# EAGLE design Esquema-Eletrico (EAGLE 9.3.0)
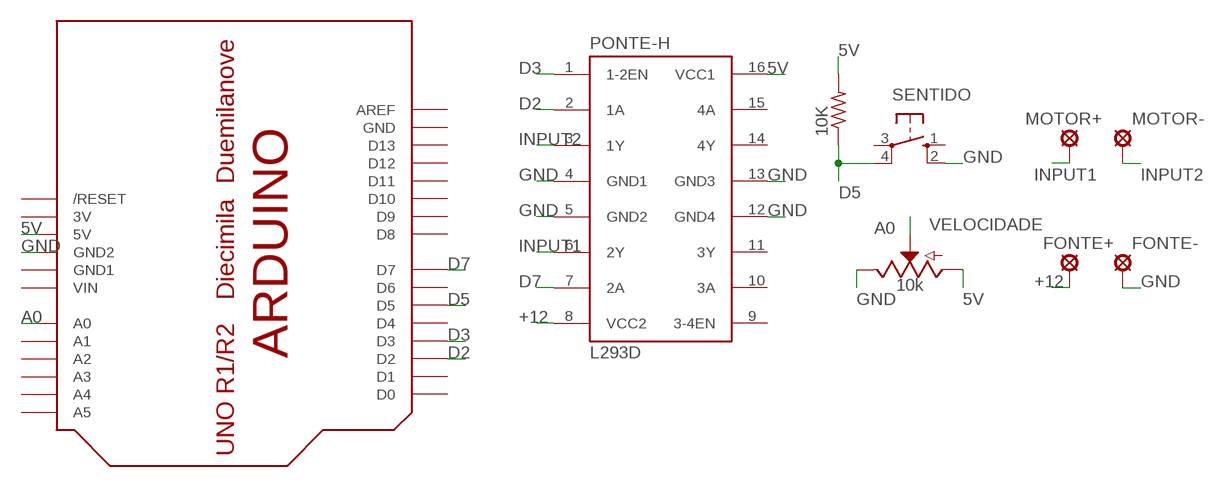
[diagram p0: schematic, sheet 1]

## Parts
10K  R-US_0207/12  [0207/12]
FONTE+  LSP10  [LSP10]
FONTE-  LSP10  [LSP10]
MOTOR+  LSP10  [LSP10]
MOTOR-  LSP10  [LSP10]
PONTE-H  L293D  [DIL16]
SENTIDO  10-XX  [B3F-10XX]
U$1  ARDUINOUNO  [ARDUINO]
VELOCIDADE  10k  POTENTIOMETER-PTH-9MM-1/20W-20%  [POT-PTH-ALPS]

## Nets
5V: 10K.2 PONTE-H.16(VCC1) U$1.5V VELOCIDADE.P$3(A)
+12: FONTE+.MP PONTE-H.8(VCC2)
A0: U$1.A0 VELOCIDADE.P$2(S)
D2: PONTE-H.2(1A) U$1.D2
D3: PONTE-H.1(1-2EN) U$1.D3
D5: 10K.1 SENTIDO.4(P1) U$1.D5
D7: PONTE-H.7(2A) U$1.D7
GND: FONTE-.MP PONTE-H.4(GND1) PONTE-H.5(GND2) PONTE-H.12(GND4) PONTE-H.13(GND3) SENTIDO.2(S1) U$1.GND2 VELOCIDADE.P$1(E)
INPUT1: MOTOR+.MP PONTE-H.6(2Y)
INPUT2: MOTOR-.MP PONTE-H.3(1Y)
Unconnected: PONTE-H.9(3-4EN) PONTE-H.10(3A) PONTE-H.11(3Y) PONTE-H.14(4Y) PONTE-H.15(4A) SENTIDO.1(S) SENTIDO.3(P) U$1.A1 U$1.A2 U$1.A3 U$1.A4 U$1.A5 U$1.AREF U$1.D0 U$1.D1 U$1.D4 U$1.D6 U$1.D8 U$1.D9 U$1.D10 U$1.D11 U$1.D12 U$1.D13 U$1.RESET(/RESET)

## Power pins joined to a net without a drawn wire
3V: U$1.3V
GND: U$1.GND
GND1: U$1.GND1
VIN: U$1.VIN

## Library data of the parts
10K = rcl:R-US_: RESISTOR, American symbol; SPICEPREFIX: R
FONTE+ FONTE- MOTOR+ MOTOR- = solpad:LSP10: SOLDER PAD drill 1.0 mm, distributor Buerklin, 12H555
PONTE-H = st-microelectronics:L293D: PUSH-PULL 4 CHANNEL DRIVER
SENTIDO = switch-omron:10-XX: OMRON SWITCH; MPN: B3F-1000; OC_FARNELL: 176432; OC_NEWARK: 36M3542
U$1 = adafruit:ARDUINO: Arduino Diecimila/Duemilanove Make a shield with ease, this package has all the named pins as well as the two mounting drill holes and an outline of the USB and DC power connector. The outline is on the DIMENSION layer, so if your board house uses it they will cut the outline to match. http://www.ladyada.net/library/pcb/eaglelibrary.html
VELOCIDADE = SparkFun-Resistors:POTENTIOMETER: Potentiometer (Pot) Three-terminal potentiometers, with an adjustable wiper and two adjustable resistors. A pot can be used to create a configurable voltage divider, or as a variable resistor. Variants ALPS_POT and ALPS_POT_KIT - PTH, breadboard compatible, 9mm square pots Rotary Potentiometer - Linear (10k ohm) <https://www.sparkfun.com/products/9288> (COM-09288) The KIT variant exposes copper on only one side of the PTH pad, so the part can only be assembled on one side of the PCB. Useful for beginner soldering kits.; PROD_ID: RES-09177; SF_SKU: COM-09288

## Net classes
0 default: width 0.6 mm, drill 1 mm, clearance 0.25 mm

## Board
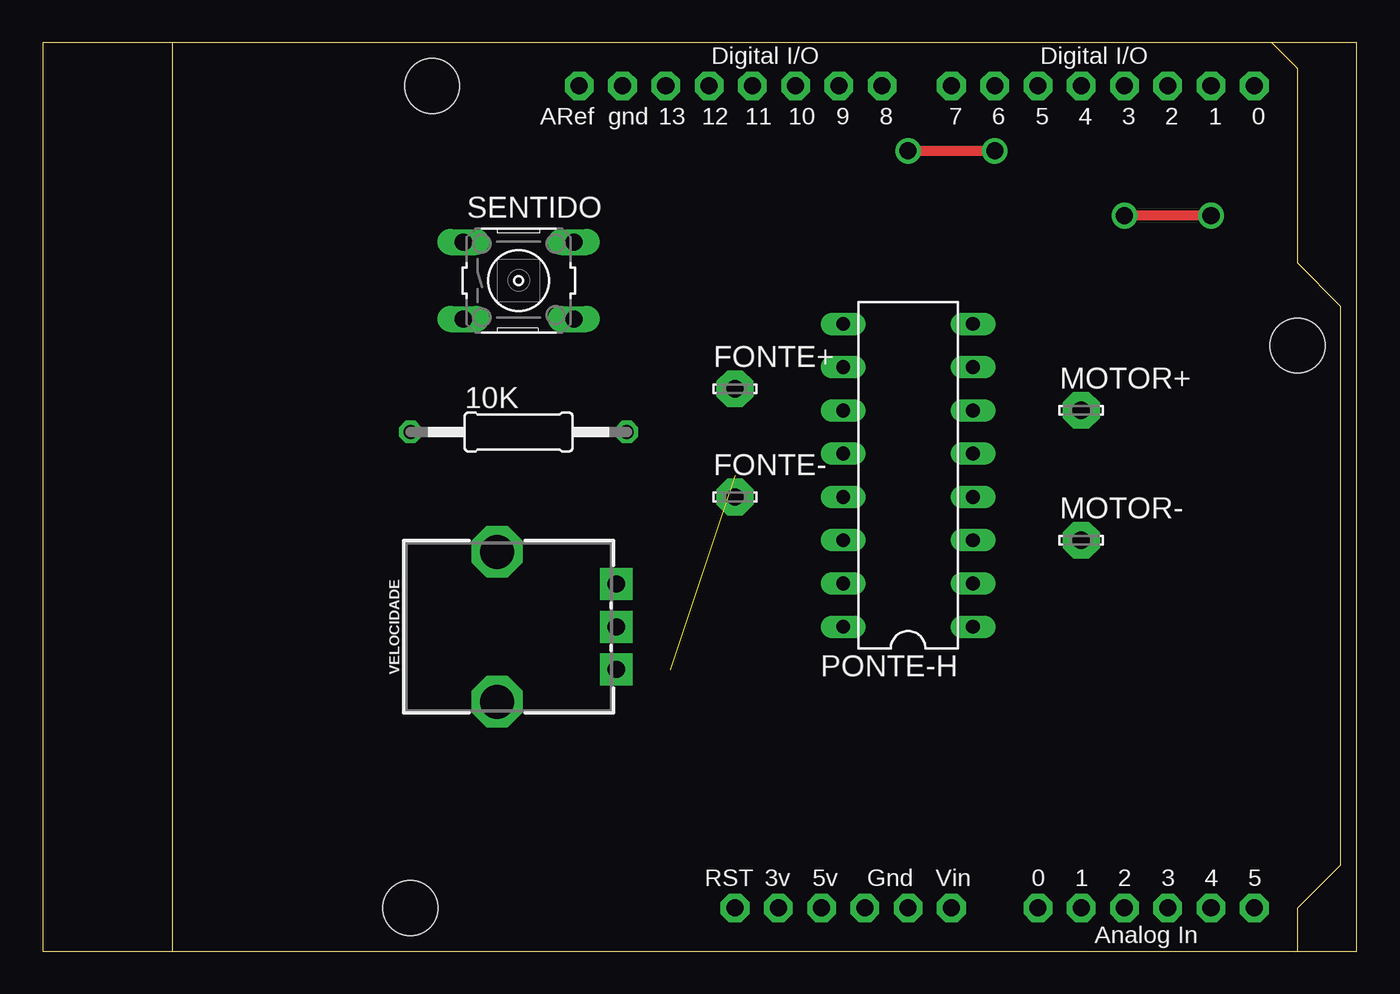
[diagram p1: board, top side]
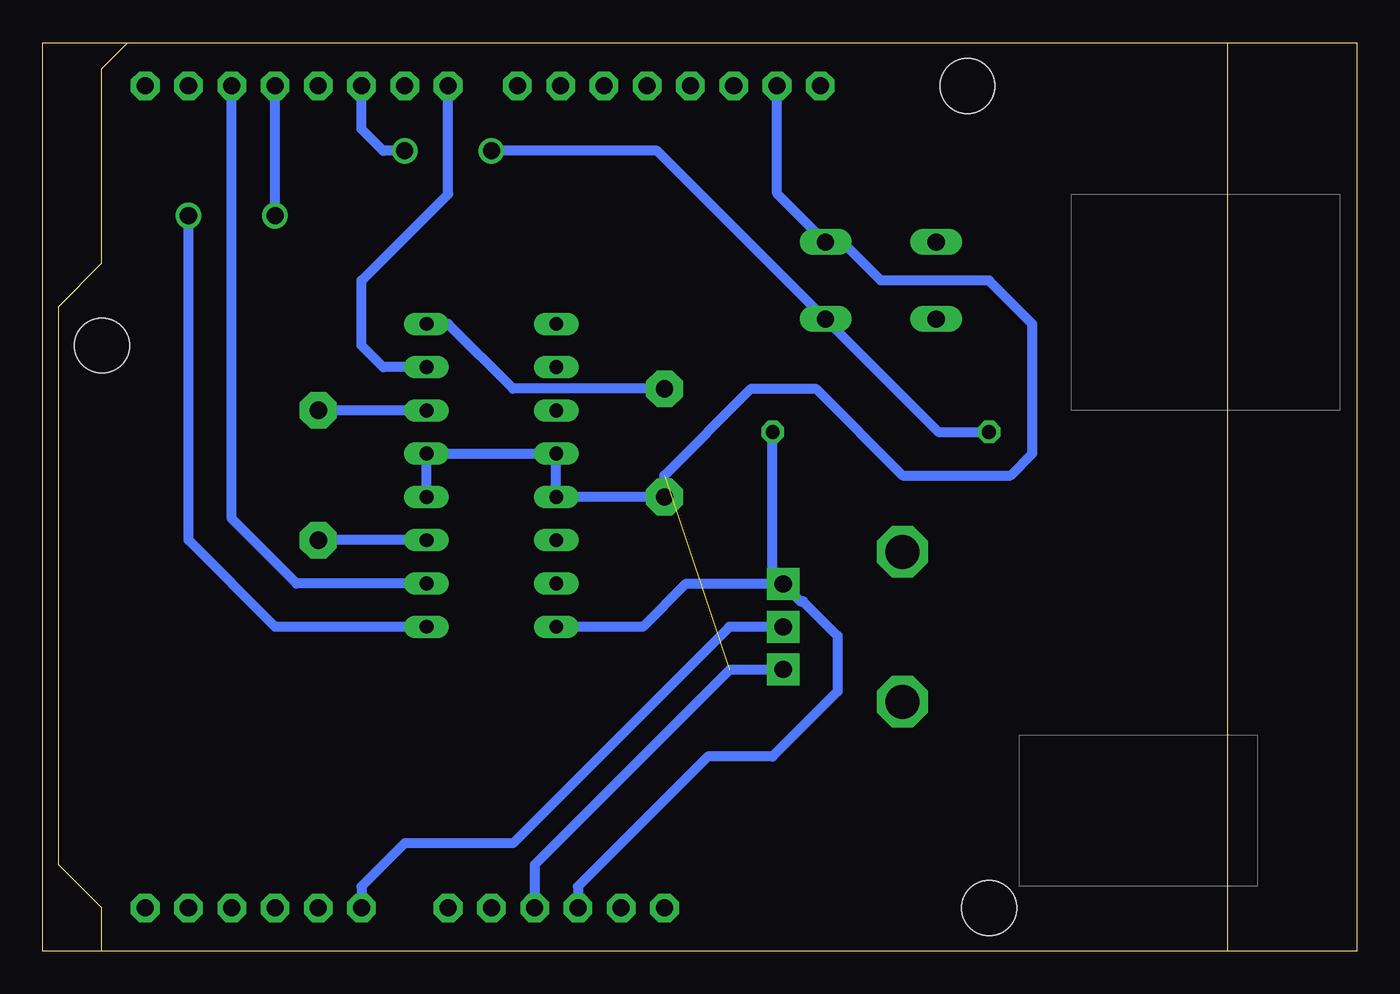
[diagram p2: board, bottom side, seen from below]

Size 77.14 x 53.34 mm. Coordinates in mm from the lower left corner, seen from the top.
Outline: 0,0 77.14,0 77.14,53.33 0,53.33 0,0
Copper layers (1*16): Top 0.035mm / dielectric 1.5mm / Bottom 0.035mm
Design rules "default": minimum track width 6mil, minimum drill 0.35mm, track to track 6mil, track to pad 6mil, pad to pad 6mil, via to via 6mil, smd to smd 6mil, copper to edge 40mil, drill to drill 6mil, minimum pad ring 10mil, minimum via ring 8mil, stop-mask expansion 4mil, vias tented up to drill 0mil, thermal gap 10mil

### Footprints (pad centres in the part's own frame; a part is rotated, then mirrored left to right if it is on the bottom)
0207/12 = drill 0.813 octagon: 1 -6.35,0; 2 6.35,0
LSP10 = drill 1.016 pad 2.159 octagon: MP 0,0
DIL16 = drill 0.813 long: 1 -8.89,-3.81; 2 -6.35,-3.81; 3 -3.81,-3.81; 4 -1.27,-3.81; 5 1.27,-3.81; 6 3.81,-3.81; 7 6.35,-3.81; 8 8.89,-3.81; 9 8.89,3.81; 10 6.35,3.81; 11 3.81,3.81; 12 1.27,3.81; 13 -1.27,3.81; 14 -3.81,3.81; 15 -6.35,3.81; 16 -8.89,3.81
B3F-10XX = drill 1.016 long: 1 -3.251,2.261; 2 3.251,2.261; 3 -3.251,-2.261; 4 3.251,-2.261
ARDUINO = drill 1 pad 1.676 octagon: 3V 35.56,2.54; 5V 38.1,2.54; A0 50.8,2.54; A1 53.34,2.54; A2 55.88,2.54; A3 58.42,2.54; A4 60.96,2.54; A5 63.5,2.54; AREF 23.876,50.8; D0 63.5,50.8; D1 60.96,50.8; D2 58.42,50.8; D3 55.88,50.8; D4 53.34,50.8; D5 50.8,50.8; D6 48.26,50.8; D7 45.72,50.8; D8 41.656,50.8; D9 39.116,50.8; D10 36.576,50.8; D11 34.036,50.8; D12 31.496,50.8; D13 28.956,50.8; GND 26.416,50.8; GND1 43.18,2.54; GND2 40.64,2.54; RESET 33.02,2.54; VIN 45.72,2.54 | hole 3.2: 15.24,50.8; 66.04,35.56; 13.97,2.54
POT-PTH-ALPS = drill 1 pad 1.88 square: P$1 7,-2.5; P$2 7,0; P$3 7,2.5 | drill 2 octagon: P$4 0,-4.4; P$5 0,4.4

### Placement (x,y rotation side)
10K  27.94,30.48 0 top
FONTE+  40.64,33.02 0 top
FONTE-  40.64,26.67 0 top
MOTOR+  60.96,31.75 0 top
MOTOR-  60.96,24.13 0 top
PONTE-H  50.8,27.94 90 top
SENTIDO  27.94,39.37 0 top
U$1  7.62,0 0 top
VELOCIDADE  26.67,19.05 0 top

### Tracks (layer width: path | path; a pad name or v marks a point on that pad's centre or on a via)
5V
  Bottom 0.6: VELOCIDADE.P$3 32.66,20.54 32.5,20.54 30.48,18.52 30.48,15.24 34.29,11.43 38.1,11.43 45.72,3.81 U$1.5V | VELOCIDADE.P$3 39.41,21.55 41.91,19.05 PONTE-H.16 | VELOCIDADE.P$3 34.29,22.17 10K.2
+12
  Bottom 0.6: FONTE+.MP 49.53,33.02 53.34,36.83 PONTE-H.8
A0
  Bottom 0.6: VELOCIDADE.P$2 36.83,19.05 49.53,6.35 55.88,6.35 58.42,3.81 U$1.A0
D2
  Bottom 0.6: PONTE-H.2 62.23,21.59 66.04,25.4 U$1.D2
D3  (via drill 1)
  Top 0.6: v68.58,43.18 v63.5,43.18
  Bottom 0.6: v68.58,43.18 68.58,24.13 63.5,19.05 PONTE-H.1 | v63.5,43.18 U$1.D3
D5  (via drill 1)
  Top 0.6: v50.8,46.99 v55.88,46.99
  Bottom 0.6: 10K.1 24.56,30.48 SENTIDO.4 41.07,46.99 v50.8,46.99 | v55.88,46.99 57.15,46.99 58.42,48.26 U$1.D5
D7
  Bottom 0.6: PONTE-H.7 57.15,34.29 58.42,35.56 58.42,39.37 53.34,44.45 U$1.D7
GND  (1 unrouted)
  Bottom 0.6: U$1.GND 34.04,44.48 SENTIDO.2 30.2,41.63 27.94,39.37 21.59,39.37 19.05,36.83 19.05,29.21 20.32,27.94 26.67,27.94 31.75,33.02 35.56,33.02 40.64,27.94 FONTE-.MP PONTE-H.13 PONTE-H.12 PONTE-H.5 PONTE-H.4 | VELOCIDADE.P$1 33.71,16.51 36.83,16.51 48.26,5.08 U$1.GND2
INPUT1
  Bottom 0.6: PONTE-H.6 MOTOR+.MP
INPUT2
  Bottom 0.6: PONTE-H.3 MOTOR-.MP